# Altium project LightBoard.PrjPcb
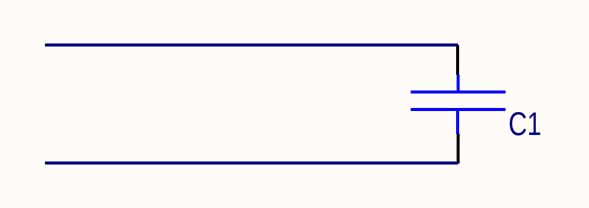
[diagram p0: Sheet1.SchDoc]
1 sheet, 1 parts. Net scope: global (net labels, ports and power ports of the same name join across sheets).
Board file: PCB1.PcbDoc

## Sheet Sheet1.SchDoc
size A4; SheetNumber: 1; SheetTotal: 1

### Parts
C1  C1206-2000B-1000пФ-10%-X7R (CCTC, TCC1206X7R102K202DTS)  [CC1206-KL]  (value not drawn)

### Nets

Not connected (* = marked no-connect by the designer): C1 1 2

### Library data of the parts
C1 = C1206: Value: C1206-2000B-1000пФ-10%-X7R (CCTC, TCC1206X7R102K202DTS)